# EAGLE design 6Ch_24Bit_FB_FeatherWing (EAGLE 9.1.3)
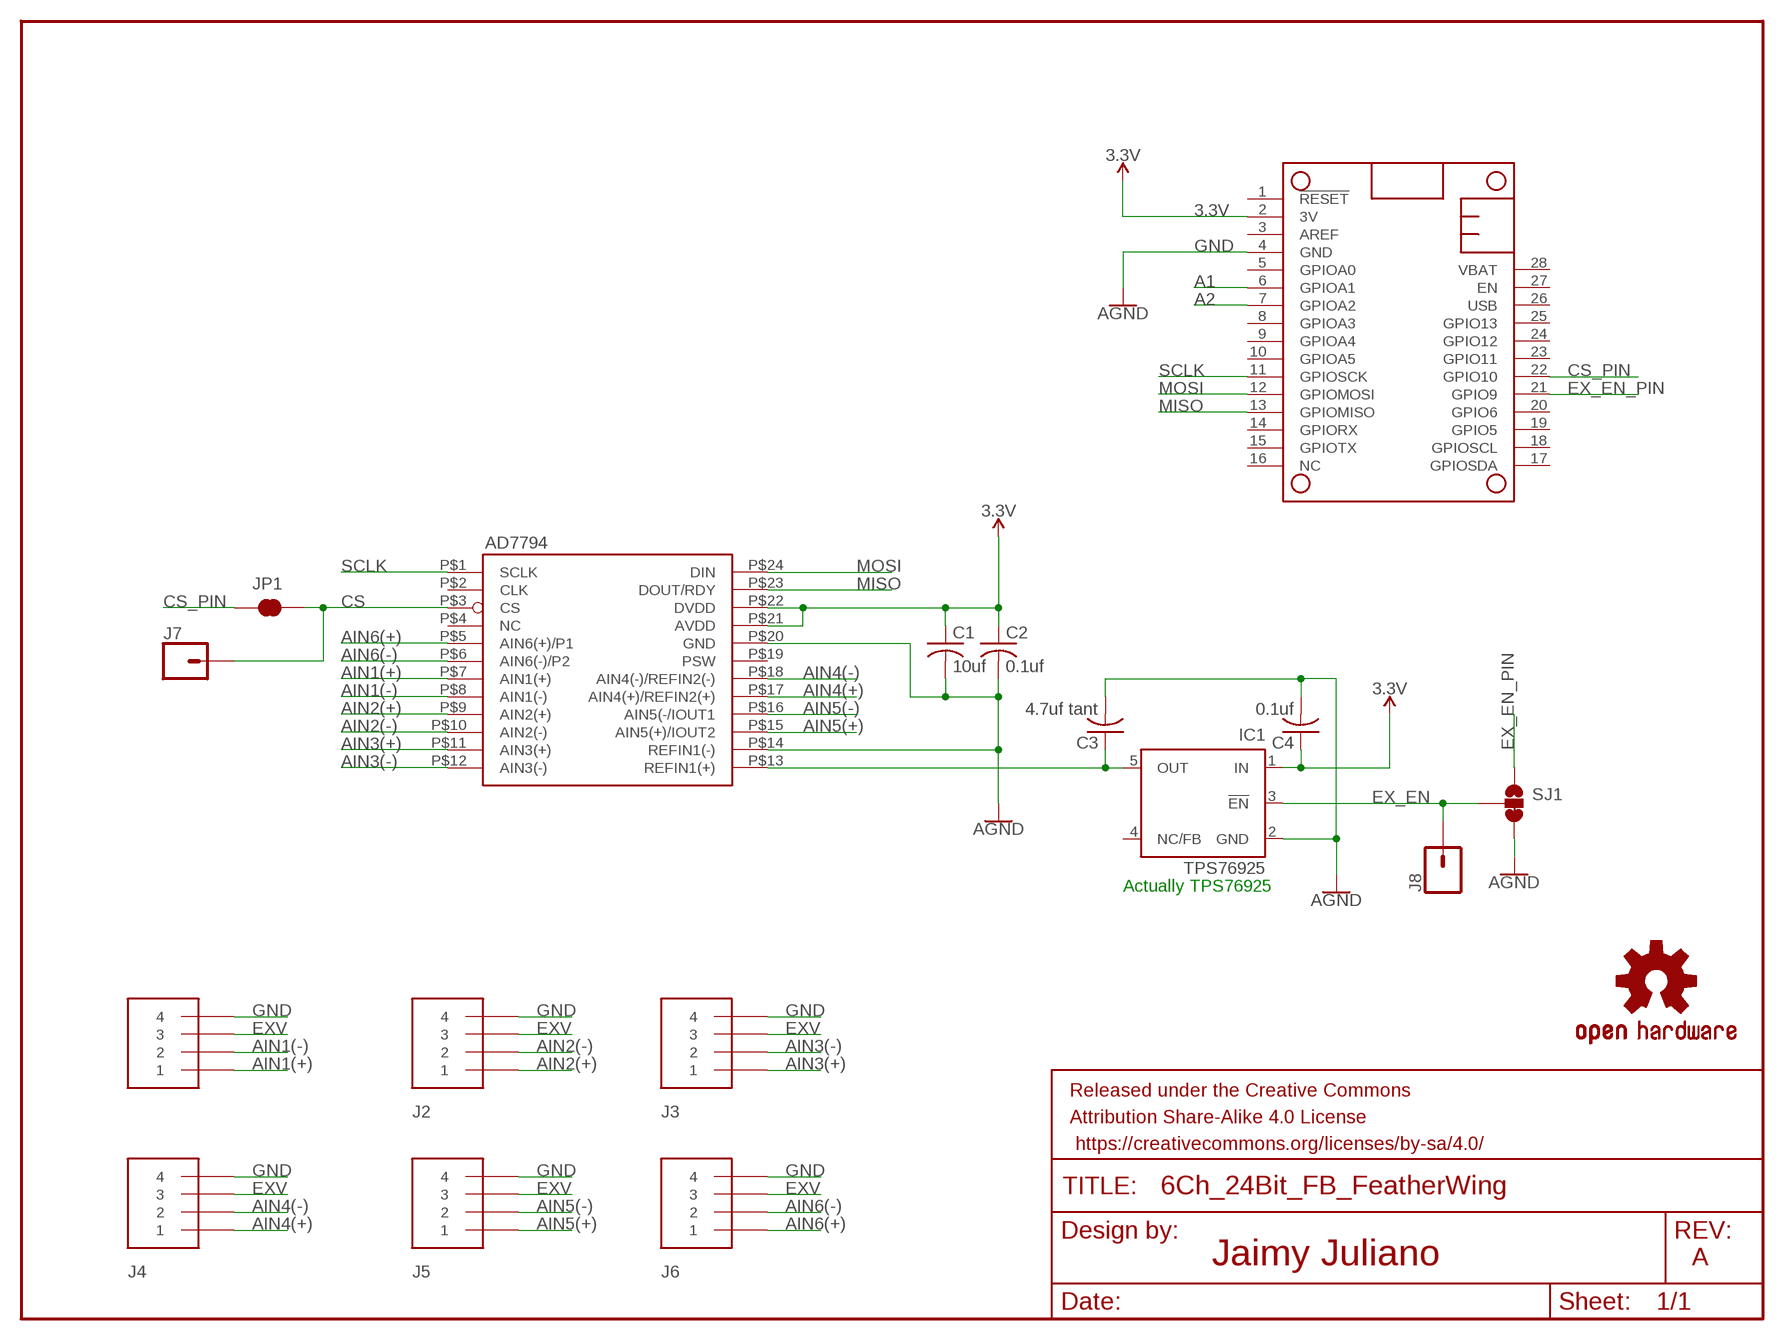
[diagram p0: schematic, sheet 1]

## Parts
C1  10uf  C-USC0603  [C0603]
C2  0.1uf  C-USC0603  [C0603]
C3  4.7uf tant  C-USC1206K  [C1206K]
C4  0.1uf  C-USC0603  [C0603]
FRAME2  FRAME-LETTER  [CREATIVE_COMMONS]
IC1  TPS76925  TPS77025  [SOT23-DBV]
J1  CON_PTSM_SOCKET-4-PTH-VERT  [CON_PTSM_SOCKET-4-PTH-VERT]
J2  CON_PTSM_SOCKET-4-PTH-VERT  [CON_PTSM_SOCKET-4-PTH-VERT]
J3  CON_PTSM_SOCKET-4-PTH-VERT  [CON_PTSM_SOCKET-4-PTH-VERT]
J4  CON_PTSM_SOCKET-4-PTH-VERT  [CON_PTSM_SOCKET-4-PTH-VERT]
J5  CON_PTSM_SOCKET-4-PTH-VERT  [CON_PTSM_SOCKET-4-PTH-VERT]
J6  CON_PTSM_SOCKET-4-PTH-VERT  [CON_PTSM_SOCKET-4-PTH-VERT]
J7  CONN_01PTH_NO_SILK_YES_STOP  [1X01_NO_SILK]
J8  CONN_01PTH_NO_SILK_YES_STOP  [1X01_NO_SILK]
JP1  JUMPER-SMT_2_NC_TRACE_NO-SILK  [SMT-JUMPER_2_NC_TRACE_NO-SILK]
LOGO1  OSHW-LOGOS  [OSHW-LOGO-S]
MS1  FEATHERWING_NODIM  [FEATHERWING_DIM]
SJ1  JUMPER-SMT_3_1-NC_TRACE_NO-SILK  [SMT-JUMPER_3_1-NC_TRACE_NO-SILK]
U1  AD7794  [TSSOP-24]

## Nets
3.3V: C1.1 C2.1 C4.1 IC1.1(IN) MS1.2(3V) U1.P$21(AVDD) U1.P$22(DVDD)
A1: MS1.6(GPIOA1)
A2: MS1.7(GPIOA2)
AIN1(+): J1.P$1 U1.P$7(AIN1(+))
AIN1(-): J1.P$2 U1.P$8(AIN1(-))
AIN2(+): J2.P$1 U1.P$9(AIN2(+))
AIN2(-): J2.P$2 U1.P$10(AIN2(-))
AIN3(+): J3.P$1 U1.P$11(AIN3(+))
AIN3(-): J3.P$2 U1.P$12(AIN3(-))
AIN4(+): J4.P$1 U1.P$17(AIN4(+)/REFIN2(+))
AIN4(-): J4.P$2 U1.P$18(AIN4(-)/REFIN2(-))
AIN5(+): J5.P$1 U1.P$15(AIN5(+)/IOUT2)
AIN5(-): J5.P$2 U1.P$16(AIN5(-/IOUT1)
AIN6(+): J6.P$1 U1.P$5(AIN6(+)/P1)
AIN6(-): J6.P$2 U1.P$6(AIN6(-)/P2)
CS: J7.1 JP1.2 U1.P$3(CS)
CS_PIN: JP1.1 MS1.22(GPIO10)
EX_EN: IC1.3(!EN) J8.1 SJ1.2
EX_EN_PIN: MS1.21(GPIO9) SJ1.1
EXV: C3.1 IC1.5(OUT) J1.P$3 J2.P$3 J3.P$3 J4.P$3 J5.P$3 J6.P$3 U1.P$13(REFIN1(+))
GND: C1.2 C2.2 C3.2 C4.2 IC1.2(GND) J1.P$4 J2.P$4 J3.P$4 J4.P$4 J5.P$4 J6.P$4 MS1.4(GND) SJ1.3 U1.P$14(REFIN1(-)) U1.P$20(GND) ; supply symbol labelled AGND
MISO: MS1.13(GPIOMISO) U1.P$23(DOUT/RDY)
MOSI: MS1.12(GPIOMOSI) U1.P$24(DIN)
SCLK: MS1.11(GPIOSCK) U1.P$1(SCLK)
Unconnected: IC1.4(NC/FB) MS1.1(!RESET) MS1.3(AREF) MS1.5(GPIOA0) MS1.8(GPIOA3) MS1.9(GPIOA4) MS1.10(GPIOA5) MS1.14(GPIORX) MS1.15(GPIOTX) MS1.16(NC) MS1.17(GPIOSDA) MS1.18(GPIOSCL) MS1.19(GPIO5) MS1.20(GPIO6) MS1.23(GPIO11) MS1.24(GPIO12) MS1.25(GPIO13) MS1.26(USB) MS1.27(EN) MS1.28(VBAT) U1.P$2(CLK) U1.P$4(NC) U1.P$19(PSW)

## Notes on the sheet
- Actually TPS76925
- Jaimy Juliano | A

## Library data of the parts
C1-C4 = rcl:C-US: CAPACITOR, American symbol; SPICEPREFIX: C
FRAME2 = SparkFun-Aesthetics:FRAME-LETTER: Schematic Frame - Letter Standard 8.5x11 US Letter frame
IC1 = texas:TPS770*: ULTRALOW-POWER 50-mA LOW-DROPOUT LINEAR REGULATORS 50-mA Low-Dropout Regulator Source: http://focus.ti.com/lit/ds/symlink/tps77001.pdf
J1-J6 = PikiTech:CON_PTSM_SOCKET-4-PTH-VERT
J7 J8 = SparkFun-Connectors:CONN_01: Single connection point. Often used as Generic Header-pin footprint for 0.1 inch spaced/style header connections On any of the 0.1 inch spaced packages, you can populate with these: Break Away Headers - Straight <https://www.sparkfun.com/products/116> (PRT-00116) Break Away Male Headers - Right Angle <https://www.sparkfun.com/products/553> (PRT-00553) Female Headers <https://www.sparkfun.com/products/115> (PRT-00115) Break Away Headers - Machine Pin <https://www.sparkfun.com/products/117> (PRT-00117) Break Away Female Headers - Swiss Machine Pin <https://www.sparkfun.com/products/743> (PRT-00743) This device is also useful as a general connection point to wire up your design to another part of your project. Our various solder wires solder well into these plated through hole pads. Hook-Up Wire - Assortment (Stranded, 22 AWG) <https://www.sparkfun.com/products/11375> (PRT-11375) Hook-Up Wire - Assortment (Solid Core, 22 AWG) <https://www.sparkfun.com/products/11367> (PRT-11367) View the entire wire category on our website here <https://www.sparkfun.com/categories/141> Special notes: SMTSO-256-ET is a "flush mount" nut for a 4-40 screw. We mostly use this on specialty testbeds; it is a nice way to connect hardware to your PCB at an adjustable hieght. Also note, the SNAP packages are for using a snappable style connector. We sell a baggie of snaps and they are also used on two LilyPad designs: Snap Assortment - 30 pack (male and female) <https://www.sparkfun.com/products/11347> (DEV-11347) LilyPad Arduino SimpleSnap <https://www.sparkfun.com/products/10941> (DEV-10941) LilyPad SimpleSnap Protoboard <https://www.sparkfun.com/products/10940> (DEV-10940)
JP1 = SparkFun-Jumpers:JUMPER-SMT_2_NC_TRACE: Normally closed trace jumper This jumper has a trace between two pads so it's normally closed (NC). Use a razor knife to open the connection. For best results follow the IPC guidelines for cutting traces: Cutout at least 0.063 mm (0.005 in). Remove all loose material to clean up the cut area. Seal the cut with an approved epoxy. Reapply solder to reclose the connection.
LOGO1 = SparkFun-Aesthetics:OSHW-LOGO: Open-Source Hardware (OSHW) Logo This logo indicates the piece of hardware it is found on incorporates a OSHW license and/or adheres to the definition of open source hardware found here: http://freedomdefined.org/OSHW
MS1 = adafruit:FEATHERWING
SJ1 = SparkFun-Jumpers:JUMPER-SMT_3_1-NC_TRACE: Normally closed trace jumper (1 of 2 connections) This jumper has a trace between two pads so it's normally closed (NC). The other connection is normally open (NO). Use a razor knife to open the connection. For best results follow the IPC guidelines for cutting traces: Cutout at least 0.063 mm (0.005 in). Remove all loose material to clean up the cut area. Seal the cut with an approved epoxy. Reapply solder to reclose the connection, or to close the NO connection.
U1 = PikiTech:AD7794: 6ch 24bit s/d ADC

## Board
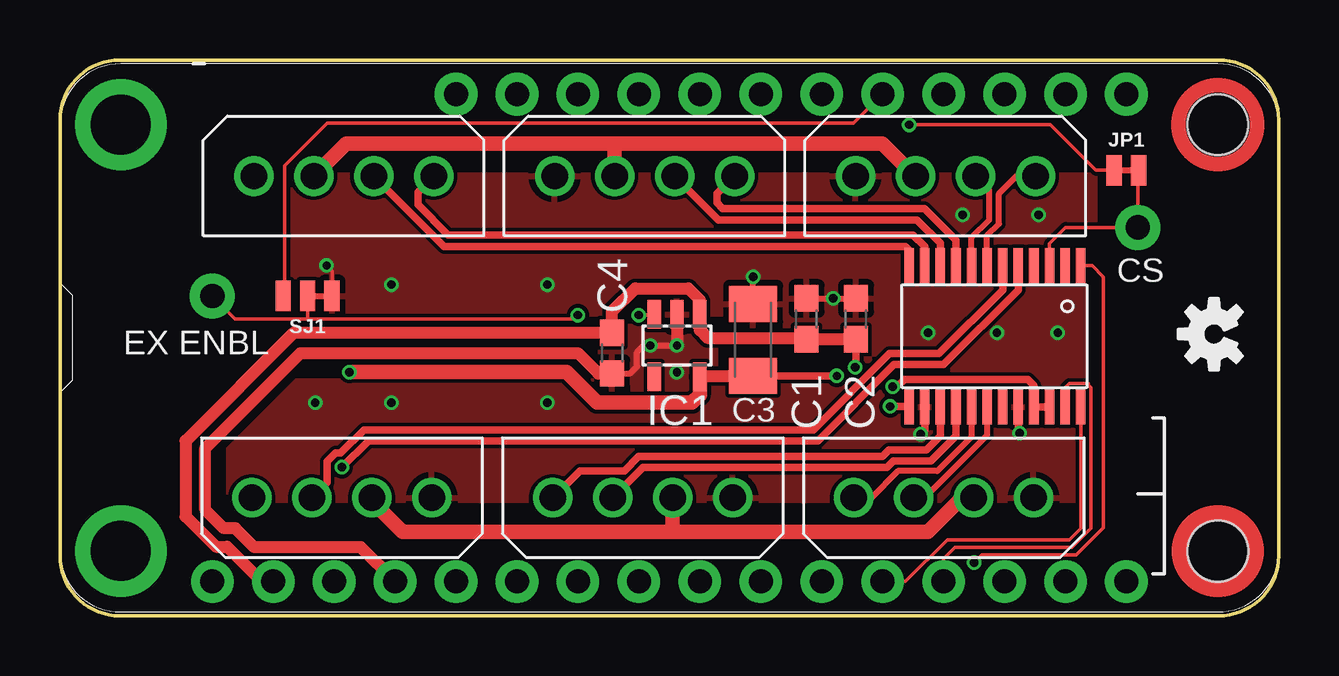
[diagram p1: board, top side]
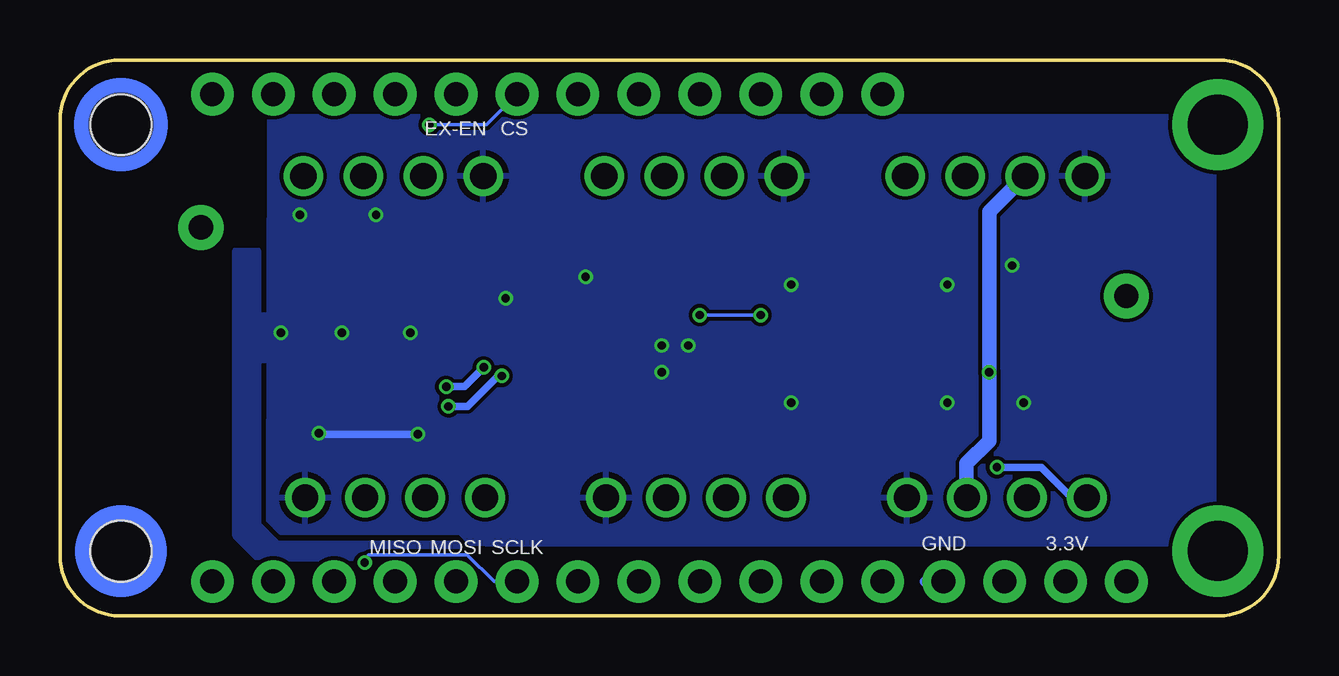
[diagram p2: board, bottom side, seen from below]

Size 50.8 x 23.18 mm. Coordinates in mm from the lower left corner, seen from the top.
Outline: 2.5,0 48.3,0 arc90 50.8,2.5 50.8,20.68 arc90 48.3,23.18 2.5,23.18 arc90 0,20.68 0,2.5 arc90 2.5,0
Copper layers (1*16): Top 0.035559375mm / dielectric 1.6mm / Bottom 0.035559375mm
Design rules "oshpark-2layer *": minimum track width 6mil, minimum drill 10mil, track to track 6mil, track to pad 6mil, pad to pad 6mil, via to via 6mil, smd to smd 6mil, copper to edge 15mil, drill to drill 6mil, minimum pad ring 5mil, minimum via ring 5mil, stop-mask expansion 2.5mil, vias tented up to drill 0mil, thermal gap 10mil

### Footprints (pad centres in the part's own frame; a part is rotated, then mirrored left to right if it is on the bottom)
C0603 = smd 1.1 x 1: 1 -0.85,0; 2 0.85,0
C1206K = smd 1.5 x 2: 1 -1.5,0; 2 1.5,0
SOT23-DBV = smd 0.55 x 1.2: 1 -0.95,-1.3; 2 0,-1.3; 3 0.95,-1.3; 4 0.95,1.3; 5 -0.95,1.3
CON_PTSM_SOCKET-4-PTH-VERT = drill 1.1: P$1 -3.75,0; P$2 -1.25,0; P$3 1.25,0; P$4 3.75,0
1X01_NO_SILK = drill 1.016 pad 1.88: 1 0,0
SMT-JUMPER_2_NC_TRACE_NO-SILK = smd 0.635 x 1.27: 1 -0.508,0; 2 0.508,0
FEATHERWING_DIM = drill 1 pad 1.778: 1 6.35,1.27; 2 8.89,1.27; 3 11.43,1.27; 4 13.97,1.27; 5 16.51,1.27; 6 19.05,1.27; 7 21.59,1.27; 8 24.13,1.27; 9 26.67,1.27; 10 29.21,1.27; 11 31.75,1.27; 12 34.29,1.27; 13 36.83,1.27; 14 39.37,1.27; 15 41.91,1.27; 16 44.45,1.27; 17 44.45,21.59; 18 41.91,21.59; 19 39.37,21.59; 20 36.83,21.59; 21 34.29,21.59; 22 31.75,21.59; 23 29.21,21.59; 24 26.67,21.59; 25 24.13,21.59; 26 21.59,21.59; 27 19.05,21.59; 28 16.51,21.59 | drill 2.5 pad 3.81: P$1 2.54,20.32; P$2 2.54,2.54 | hole 2.54: 48.26,20.32; 48.26,2.54
SMT-JUMPER_3_1-NC_TRACE_NO-SILK = smd 0.635 x 1.27: 1 -1.016,0; 2 0,0; 3 1.016,0
TSSOP-24 = smd 1.45 x 0.4: P$1 0,0; P$2 0,-0.65; P$3 0,-1.3; P$4 0,-1.95; P$5 0,-2.6; P$6 0,-3.25; P$7 0,-3.9; P$8 0,-4.55; P$9 0,-5.2; P$10 0,-5.85; P$11 0,-6.5; P$12 0,-7.15; P$13 5.9,-7.15; P$14 5.9,-6.5; P$15 5.9,-5.85; P$16 5.9,-5.2; P$17 5.9,-4.55; P$18 5.9,-3.9; P$19 5.9,-3.25; P$20 5.9,-2.6; P$21 5.9,-1.95; P$22 5.9,-1.3; P$23 5.9,-0.65; P$24 5.9,0

### Placement (x,y rotation side)
C1  31.11,12.38 90 top
C2  33.18,12.38 90 top
C3  28.89,11.51 90 top
C4  23.02,10.95 270 top
FRAME2  3.02,-11.43 0 top  (outside the outline)
IC1  25.72,11.27 180 top
J1  36.91,18.34 180 top
J2  24.37,18.34 180 top
J3  11.83,18.34 180 top
J4  36.83,4.92 0 top
J5  24.29,4.92 0 top
J6  11.75,4.92 0 top
J7  44.93,16.19 0 top
J8  6.35,13.33 0 top
JP1  44.45,18.57 0 top
LOGO1  48.1,11.75 90 top
MS1  0,0.16 0 top
SJ1  10.32,13.33 0 top
U1  42.55,14.6 270 top

### Tracks (layer width: path | path; a pad name or v marks a point on that pad's centre or on a via)
3.3V  (via drill 0.35)
  Top 0.305: U1.P$22 U1.P$21 40.59,9.61 40.34,9.86 35.2,9.86 34.89,9.55 v34.7,9.55 | C2.1 33.18,10.39 v33.14,10.36
  Top 0.508: C2.1 C1.1 31.06,11.59 26.99,11.59 26.67,11.91 IC1.1 26.67,13.17 26.67,13.18 26.19,13.65 23.97,13.65 23.02,12.7 C4.1 9.74,11.8 5.24,7.3 5.24,4.15 6.5,2.88 6.96,2.88 8.41,1.43 MS1.2
  Bottom 0.305: v33.14,10.36 33.94,9.55 v34.7,9.55
AIN1(+)
  Top 0.254: U1.P$7 38.65,15.85 39.14,16.34 39.14,17.61 39.87,18.34 J1.P$1
AIN1(-)
  Top 0.254: U1.P$8 37.99,15.77 38.73,16.51 38.73,17.76 J1.P$2
AIN2(+)
  Top 0.305: U1.P$9 37.34,15.68 36.04,16.99 27.61,16.99 27.38,17.22 27.38,17.6 J2.P$1
AIN2(-)
  Top 0.305: U1.P$10 36.7,15.53 35.72,16.51 27.44,16.51 J2.P$2
AIN3(+)
  Top 0.305: U1.P$11 36.05,15.39 35.56,15.87 16.18,15.87 14.92,17.14 14.92,17.68 J3.P$1
AIN3(-)
  Top 0.305: U1.P$12 35.4,15.25 35.24,15.4 16.01,15.4 J3.P$2
AIN4(+)
  Top 0.254: U1.P$17 37.99,7.45 36.57,6.03 34.92,6.03 33.81,4.92 J4.P$1
AIN4(-)
  Top 0.254: U1.P$18 38.65,7.53 36.04,4.92 J4.P$2
AIN5(+)
  Top 0.305: J5.P$1 21.67,6.05 23.52,6.05 24.12,6.65 34.28,6.65 34.56,6.92 36.12,6.92 36.7,7.5 U1.P$15
AIN5(-)
  Top 0.305: U1.P$16 37.34,7.5 36.31,6.46 34.75,6.46 34.47,6.19 24.31,6.19 J5.P$2
AIN6(+)  (via drill 0.35)
  Top 0.305: U1.P$5 39.95,13.59 36.83,10.48 34.77,10.48 31.59,7.3 12.86,7.3 v11.75,6.19
  Bottom 0.305: J6.P$1 8.63,4.92 9.9,6.19 v11.75,6.19
AIN6(-)
  Top 0.305: U1.P$6 39.3,13.59 36.64,10.93 34.58,10.93 31.4,7.76 12.67,7.76 11.71,6.8 11.5,6.8 11.14,6.44 11.14,5.56 J6.P$2
CS
  Top 0.152: U1.P$3 41.24,15.53 41.91,16.19 J7.1 44.93,17.59 JP1.2
CS_PIN  (via drill 0.35)
  Top 0.152: v35.4,20.48 41.27,20.48 43.18,18.57 JP1.1
  Bottom 0.152: MS1.22 33.02,20.48 v35.4,20.48
EX_EN  (via drill 0.35)
  Top 0.152: IC1.3 24.74,12.54 v24.13,12.54 | SJ1.2 10.32,12.38 | 10.32,12.38 21.59,12.38 v21.59,12.54 | J8.1 7.3,12.38 10.32,12.38
  Bottom 0.152: v24.13,12.54 v21.59,12.54
EX_EN_PIN
  Top 0.152: MS1.21 33.08,20.54 11.13,20.54 9.37,18.77 9.37,14.29 | 9.37,14.29 | 9.37,14.29 9.37,13.33 SJ1.1
EXV  (via drill 0.35)
  Top 0.305: C3.1 32.38,10.01 v32.38,10 | v34.61,8.73 35.37,8.73 U1.P$13
  Top 0.508: IC1.5 26.71,10.01 C3.1 | J4.P$3 37.6,4.92 | 13,4.78 J6.P$3 | 25.54,3.51 25.56,3.49 | 35.64,18.34 J1.P$3 | 23.12,19.63 23.18,19.68
  Top 0.61: 37.6,4.92 36.17,3.49 25.56,3.49 14.29,3.49 13,4.78 | J5.P$3 25.54,3.51 | J3.P$3 11.93,19.68 23.18,19.68 34.29,19.68 35.64,18.34 | J2.P$3 23.12,19.63 | IC1.5 26.67,9.2 26.35,8.89 22.38,8.89 21.11,10.16 v12.06,10.16
  Bottom 0.305: v32.38,10 32.54,10 33.81,8.73 v34.61,8.73
  Bottom 0.61: J6.P$3 13.02,4.94 13.02,6.35 12.06,7.3 v12.06,10.16 12.06,16.85 J3.P$3
GND  (via drill 0.35)
  Top 0.152: SJ1.3 11.34,14.38 v11.11,14.6
  Top 0.254: C4.2 23.76,10.1 24.05,10.4 24.05,11 24.32,11.27 v25.72,11.27 | C1.2 v32.23,13.23 C2.2 | C3.2 v28.89,14.13
  Top 0.305: U1.P$14 36.05,7.74 v35.88,7.57 | U1.P$20 39.95,7.68 v40.01,7.62
  Top 0.508: MS1.4 12.54,2.86 8.1,2.86 7.3,3.65 6.83,3.65 6.06,4.42 6.06,6.98 10.03,10.95 21.59,10.95 22.44,10.1 C4.2 | IC1.2 v25.72,11.27
  Bottom 0.305: v40.01,7.62 39.96,7.57 v35.88,7.57
  Bottom 0.406: MS1.4 14.75,1.43
  other vias: 24.61,11.27 25.72,10.16 36.2,11.8 39.05,11.8 41.59,11.8 13.81,13.81 13.81,8.89 10.64,8.89 37.62,16.73 40.8,16.73 20.32,8.89 20.32,13.81
  pour Bottom: 2.7,20.8 42.07,20.8 42.1,4.02 41.59,3.49 34.13,3.49 33.68,3.04 33.03,3.02 2.7,3.02
  pour Top: 22.54,13.33 27.3,13.33 27.3,9.37 22.54,9.37
  pour Top: 27.94,14.92 42.7,14.92 42.7,8.1 27.94,8.1
  pour Top: 9.68,18.42 43.18,18.42 43.18,12.54 9.68,12.54
  pour Top: 9.84,9.84 43.97,9.84 43.97,4.76 6.99,4.76 6.99,6.99
  pour Bottom (rank 3): 41.12,12.54 41.12,10.64 42.55,10.64 42.55,3.81 41.75,3.02 34.29,3.02 33.66,2.38 42.55,2.38 43.5,3.33 43.5,15.24 42.55,15.24 42.55,12.54
MISO
  Top 0.152: MS1.13 36.83,2.38 37.31,2.86 42.18,2.86 42.97,3.65 42.97,9.52 42.86,9.64 42.86,9.68 42.07,9.68 41.9,9.51 U1.P$23
MOSI
  Top 0.152: MS1.12 35.24,1.43 36.99,3.17 42.07,3.17 42.55,3.65 U1.P$24
SCLK  (via drill 0.35)
  Top 0.152: v38.1,2.22 38.42,2.55 42.37,2.55 43.5,3.67 43.5,14.13 43.02,14.6 U1.P$1
  Bottom 0.152: MS1.11 32.71,1.43 33.83,2.55 37.29,2.55 37.3,2.54 37.94,2.54 38.1,2.38 v38.1,2.22
(copper drawn outside any net)
  shapes: Bottom circle x2, Top circle x2

### Text on the board
tPlace: CS | EX ENBL
bNames: CS | EX-EN | 3.3V | GND | SCLK | MOSI | MISO
Document: Jaimy Juliano